# Altium project Kasil_DIOT_x86_board.PrjPcb (part 3 of 4)

## Sheet LOCAL_PWR.SchDoc
size 420 x 297 mm; SheetNumber: 8; SheetTotal: 11; ModifiedBy: -; CheckedDate: -; Title2: Title 2; DivGrp: WUT ISE; Designer: G.Kasprowicz
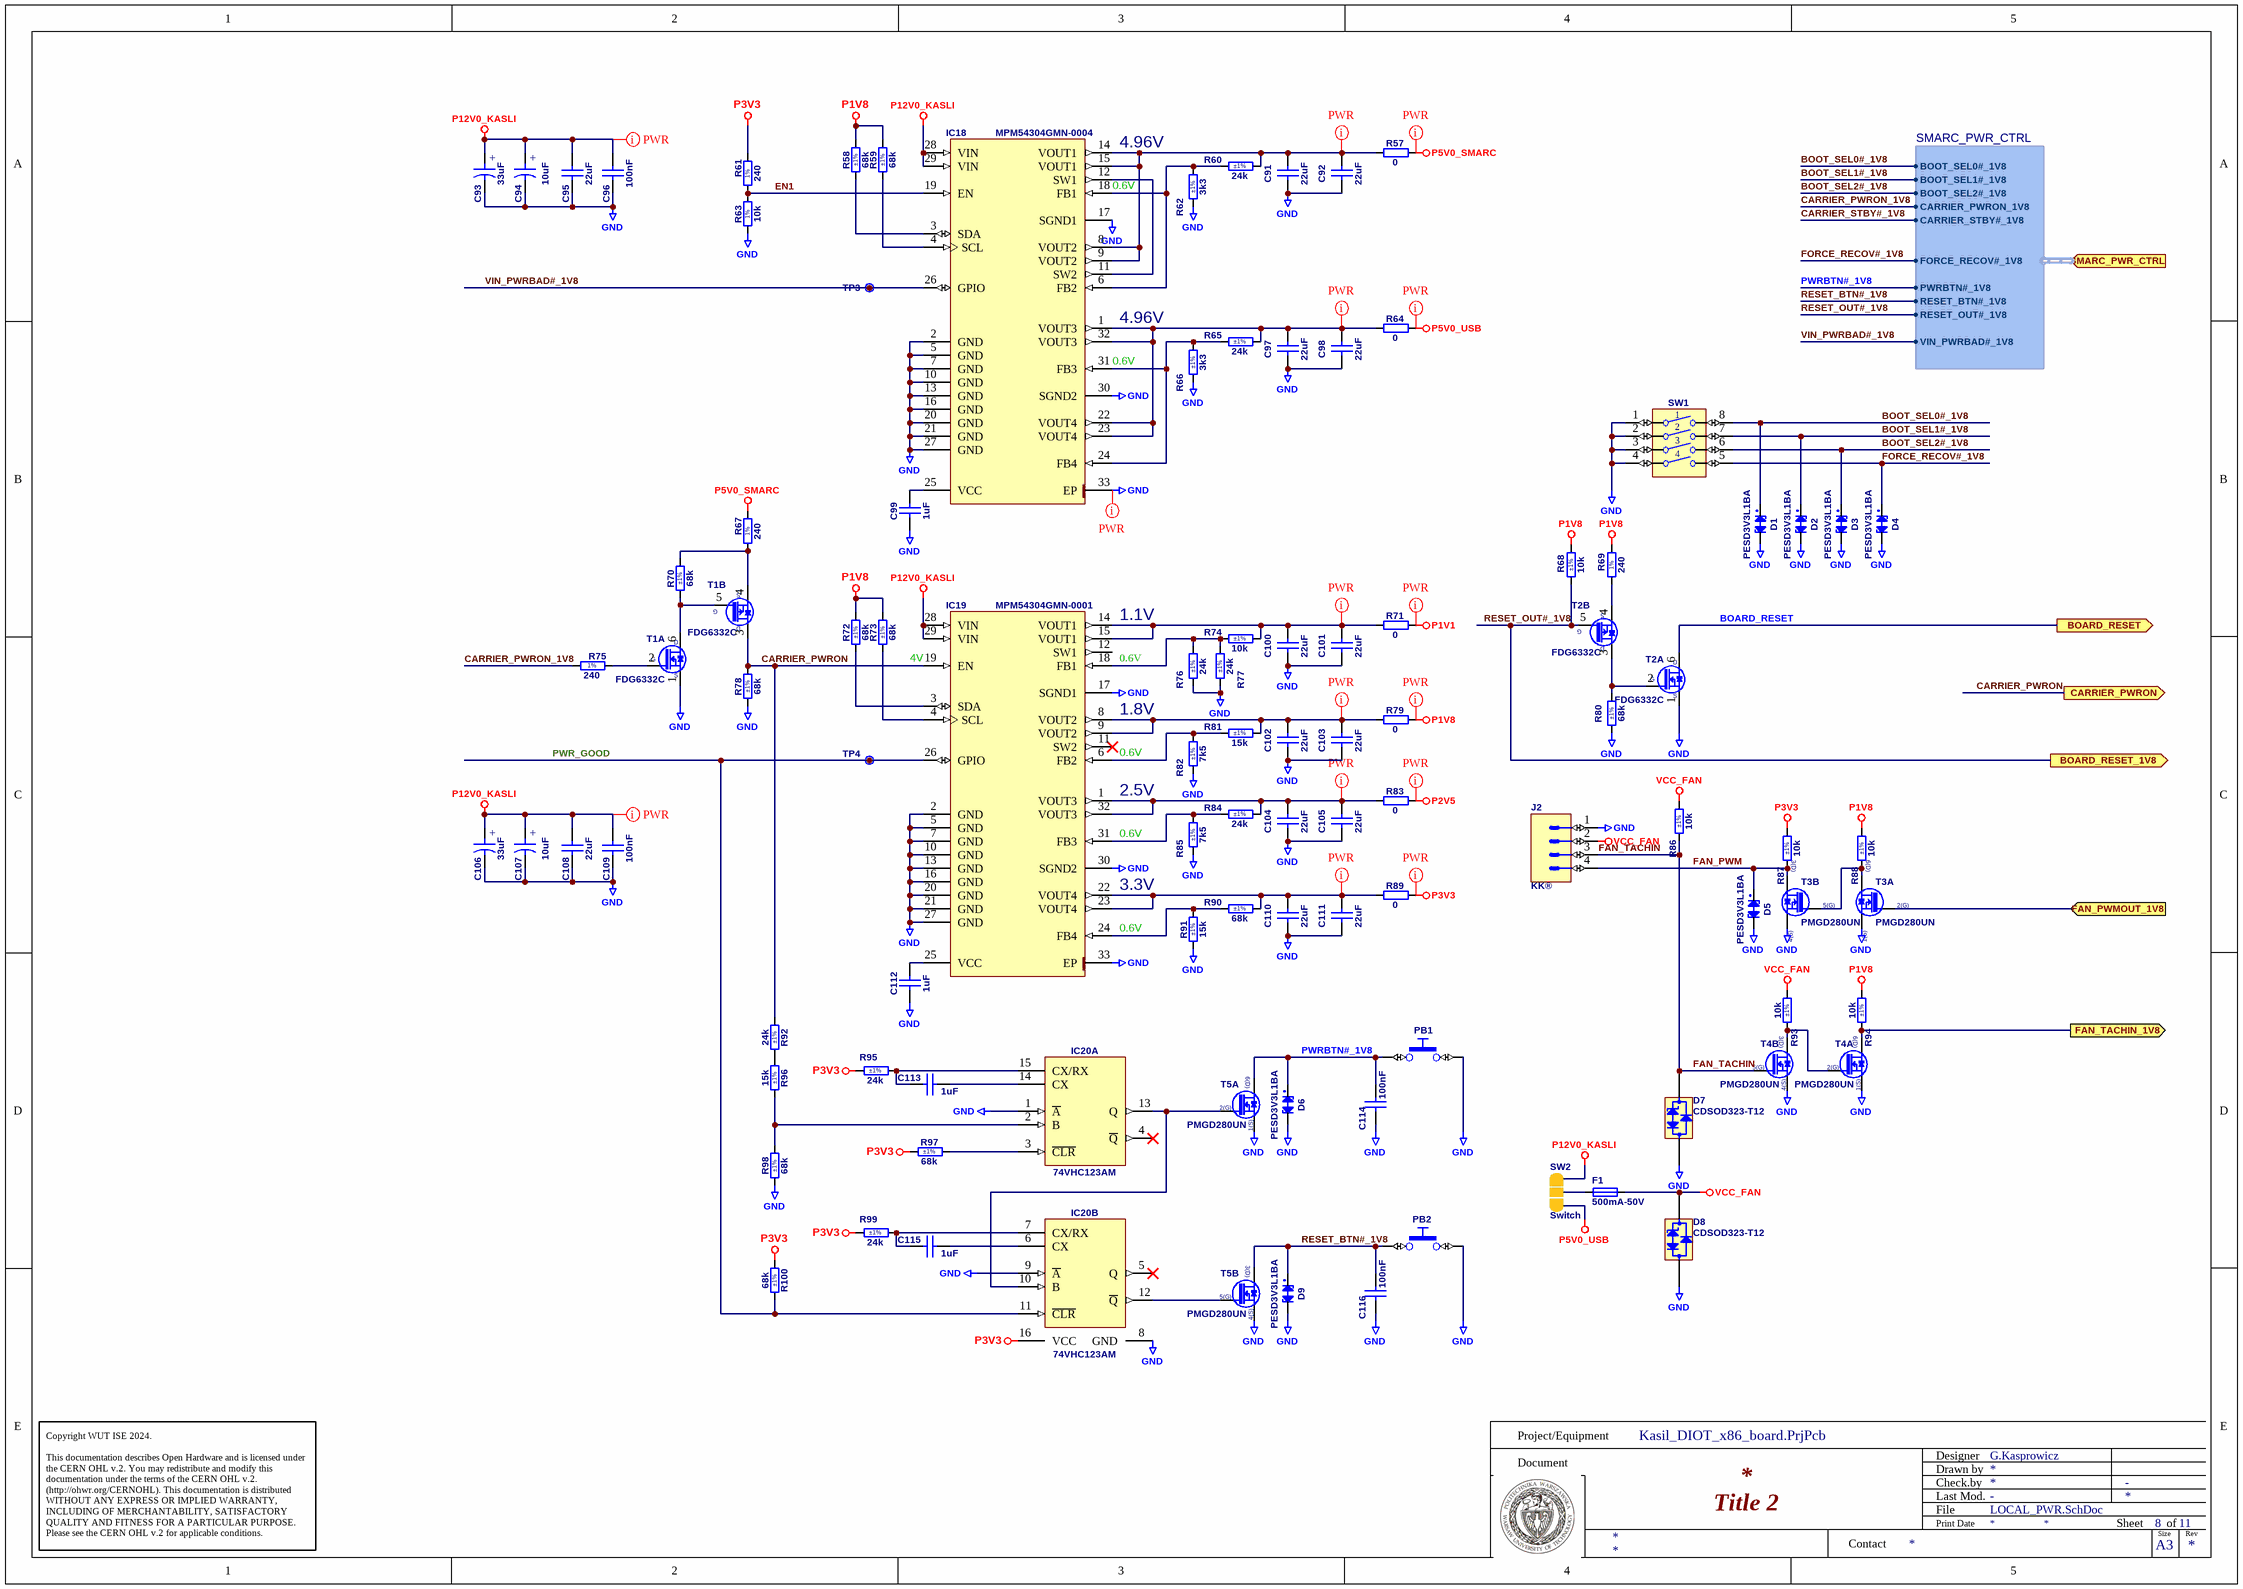
[diagram p6: LOCAL_PWR.SchDoc]

### Parts
C91  22uF  [CAPC2012X135N]
C92  22uF  [CAPC2012X135N]
C93  33uF  [CAPMP3528X210N]
C94  10uF  [CAPMP3216X180N]
C95  22uF  [CAPC2012X135N]
C96  100nF  [CAPC1005X55N]
C97  22uF  [CAPC2012X135N]
C98  22uF  [CAPC2012X135N]
C99  1uF  [CAPC1005X55N]
C100  22uF  [CAPC2012X135N]
C101  22uF  [CAPC2012X135N]
C102  22uF  [CAPC2012X135N]
C103  22uF  [CAPC2012X135N]
C104  22uF  [CAPC2012X135N]
C105  22uF  [CAPC2012X135N]
C106  33uF  [CAPMP3528X210N]
C107  10uF  [CAPMP3216X180N]
C108  22uF  [CAPC2012X135N]
C109  100nF  [CAPC1005X55N]
C110  22uF  [CAPC2012X135N]
C111  22uF  [CAPC2012X135N]
C112  1uF  [CAPC1005X55N]
C113  1uF  [CAPC1005X55N]
C114  100nF  [CAPC1005X55N]
C115  1uF  [CAPC1005X55N]
C116  100nF  [CAPC1005X55N]
D1  PESD3V3L1BA  [SOD2512X110N]
D2  PESD3V3L1BA  [SOD2512X110N]
D3  PESD3V3L1BA  [SOD2512X110N]
D4  PESD3V3L1BA  [SOD2512X110N]
D5  PESD3V3L1BA  [SOD2512X110N]
D6  PESD3V3L1BA  [SOD2512X110N]
D7  CDSOD323-T12  [SOD2513X114N]
D8  CDSOD323-T12  [SOD2513X114N]
D9  PESD3V3L1BA  [SOD2512X110N]
F1  500mA-50V  [FUSC_BOURNS_SF-0603F]
IC18  MPM54304GMN-0004  [MPS_MPM54304GMN]
IC19  MPM54304GMN-0001  [MPS_MPM54304GMN]
IC20  74VHC123AM  [SOIC127P600X175-16N]  (parts A,B of 2)
J2  KK®  [MOLEX_22-04-1041]
PB1  Push Button  [PB_TYCO_FSMSM]  (value not drawn)
PB2  Push Button  [PB_TYCO_FSMSM]  (value not drawn)
R57  0  [RESC2012X60N]
R58  68k  Tolerance: ±1%  [RESC1005X40N]
R59  68k  Tolerance: ±1%  [RESC1005X40N]
R60  24k  Tolerance: ±1%  [RESC1005X40N]
R61  240  [RESC1005X40N]
R62  3k3  Tolerance: ±1%  [RESC1005X40N]
R63  10k  [RESC1005X40N]
R64  0  [RESC2012X60N]
R65  24k  Tolerance: ±1%  [RESC1005X40N]
R66  3k3  Tolerance: ±1%  [RESC1005X40N]
R67  240  [RESC1005X40N]
R68  10k  Tolerance: ±1%  [RESC1005X40N]
R69  240  [RESC1005X40N]
R70  68k  Tolerance: ±1%  [RESC1005X40N]
R71  0  [RESC2012X60N]
R72  68k  Tolerance: ±1%  [RESC1005X40N]
R73  68k  Tolerance: ±1%  [RESC1005X40N]
R74  10k  Tolerance: ±1%  [RESC1005X40N]
R75  240  [RESC1005X40N]
R76  24k  Tolerance: ±1%  [RESC1005X40N]
R77  24k  Tolerance: ±1%  [RESC1005X40N]
R78  68k  Tolerance: ±1%  [RESC1005X40N]
R79  0  [RESC2012X60N]
R80  68k  Tolerance: ±1%  [RESC1005X40N]
R81  15k  Tolerance: ±1%  [RESC1005X40N]
R82  7k5  Tolerance: ±1%  [RESC1005X40N]
R83  0  [RESC2012X60N]
R84  24k  Tolerance: ±1%  [RESC1005X40N]
R85  7k5  Tolerance: ±1%  [RESC1005X40N]
R86  10k  Tolerance: ±1%  [RESC1005X40N]
R87  10k  Tolerance: ±1%  [RESC1005X40N]
R88  10k  Tolerance: ±1%  [RESC1005X40N]
R89  0  [RESC2012X60N]
R90  68k  Tolerance: ±1%  [RESC1005X40N]
R91  15k  Tolerance: ±1%  [RESC1005X40N]
R92  24k  Tolerance: ±1%  [RESC1005X40N]
R93  10k  Tolerance: ±1%  [RESC1005X40N]
R94  10k  Tolerance: ±1%  [RESC1005X40N]
R95  24k  Tolerance: ±1%  [RESC1005X40N]
R96  15k  Tolerance: ±1%  [RESC1005X40N]
R97  68k  Tolerance: ±1%  [RESC1005X40N]
R98  68k  Tolerance: ±1%  [RESC1005X40N]
R99  24k  Tolerance: ±1%  [RESC1005X40N]
R100  68k  Tolerance: ±1%  [RESC1005X40N]
SW1  Switch  [SW_DIPTRONICS_DHA-04TQ]  (value not drawn)
SW2  Switch  [JUMPSM3P]  (no BOM)
T1  FDG6332C  [SOT65P210X110-6N]  (parts A,B of 2)
T2  FDG6332C  [SOT65P210X110-6N]  (parts A,B of 2)
T3  PMGD280UN  [SOT65P210X110-6N]  (parts A,B of 2)
T4  PMGD280UN  [SOT65P210X110-6N]  (parts A,B of 2)
T5  PMGD280UN  [SOT65P210X110-6N]  (parts A,B of 2)
TP3  Test Point  [TPS127]  (value not drawn)  (no BOM)
TP4  Test Point  [TPS127]  (value not drawn)  (no BOM)

### Ports
BOARD_RESET (out), BOARD_RESET_1V8 (out), CARRIER_PWRON (out), FAN_PWMOUT_1V8 (in), FAN_TACHIN_1V8 (out), SMARC_PWR_CTRL (in, harness SMARC_PWR_CTRL)

### Harnesses
SMARC_PWR_CTRL: BOOT_SEL0#_1V8, BOOT_SEL1#_1V8, BOOT_SEL2#_1V8, CARRIER_PWRON_1V8, CARRIER_STBY#_1V8, FORCE_RECOV#_1V8, PWRBTN#_1V8, RESET_BTN#_1V8, RESET_OUT#_1V8, VIN_PWRBAD#_1V8

### Nets
GND: C91.1 C92.1 C93.2 C94.2 C95.1 C96.1 C97.1 C98.1 C99.1 C100.1 C101.1 C102.1 C103.1 C104.1 C105.1 C106.2 C107.2 C108.1 C109.1 C110.1 C111.1 C112.1 C114.1 C116.1 D1.2(C) D2.2(C) D3.2(C) D4.2(C) D5.2(C) D6.2(C) D7.2(A) D8.2(A) D9.2(C) IC18.2(GND) IC18.5(GND) IC18.7(GND) IC18.10(GND) IC18.13(GND) IC18.16(GND) IC18.17(SGND1) IC18.20(GND) IC18.21(GND) IC18.27(GND) IC18.30(SGND2) IC18.33(EP) IC19.2(GND) IC19.5(GND) IC19.7(GND) IC19.10(GND) IC19.13(GND) IC19.16(GND) IC19.17(SGND1) IC19.20(GND) IC19.21(GND) IC19.27(GND) IC19.30(SGND2) IC19.33(EP) IC20.1(~{A}) IC20.8(GND) IC20.9(~{A}) J2.1 PB1.2 PB2.2 R62.1 R63.1 R66.1 R76.1 R77.1 R78.1 R80.1 R82.1 R85.1 R91.1 R98.1 SW1.1 SW1.2 SW1.3 SW1.4 T1.1(S) T2.1(S) T3.1(S) T3.4(S) T4.1(S) T4.4(S) T5.1(S) T5.4(S)
P1V1: R71.2
P1V8: R58.2 R59.2 R68.2 R69.2 R72.2 R73.2 R79.2 R88.2 R94.2
P2V5: R83.2
P3V3: IC20.16(VCC) R61.2 R87.2 R89.2 R95.1 R97.1 R99.1 R100.1
P5V0_SMARC: R57.2 R67.2
P5V0_USB: R64.2 SW2.1
P12V0_KASLI: C93.1 C94.1 C95.2 C96.2 C106.1 C107.1 C108.2 C109.2 IC18.28(VIN) IC18.29(VIN) IC19.28(VIN) IC19.29(VIN) SW2.3
VCC: IC20.16(VCC)
VCC_FAN: D8.1(C) F1.2 J2.2 R86.2 R93.2
BOARD_RESET: T2.6(D) ; port BOARD_RESET
BOOT_SEL0#_1V8: D1.1(C) SW1.8 ; port SMARC_PWR_CTRL.BOOT_SEL0#_1V8
BOOT_SEL1#_1V8: D2.1(C) SW1.7 ; port SMARC_PWR_CTRL.BOOT_SEL1#_1V8
BOOT_SEL2#_1V8: D3.1(C) SW1.6 ; port SMARC_PWR_CTRL.BOOT_SEL2#_1V8
CARRIER_PWRON: IC19.19(EN) R78.2 R92.1 T1.3(D) ; port CARRIER_PWRON
CARRIER_PWRON_1V8: R75.1 ; port SMARC_PWR_CTRL.CARRIER_PWRON_1V8
EN1: IC18.19(EN) R61.1 R63.2
FAN_PWM: D5.1(C) J2.4 R87.1 T3.3(D)
FAN_TACHIN: D7.1(C) J2.3 R86.1 T4.5(G)
FORCE_RECOV#_1V8: D4.1(C) SW1.5 ; port SMARC_PWR_CTRL.FORCE_RECOV#_1V8
PWR_GOOD: IC19.26(GPIO) IC20.11(~{CLR}) R100.2 TP4.1
PWRBTN#_1V8: C114.2 D6.1(C) PB1.1 T5.6(D) ; port SMARC_PWR_CTRL.PWRBTN#_1V8
RESET_BTN#_1V8: C116.2 D9.1(C) PB2.1 T5.3(D) ; port SMARC_PWR_CTRL.RESET_BTN#_1V8
RESET_OUT#_1V8: R68.1 T2.5(G) ; port BOARD_RESET_1V8, port SMARC_PWR_CTRL.RESET_OUT#_1V8
VIN_PWRBAD#_1V8: IC18.26(GPIO) TP3.1 ; port SMARC_PWR_CTRL.VIN_PWRBAD#_1V8
NetC91_2: C91.2 C92.2 IC18.8(VOUT2) IC18.9(VOUT2) IC18.14(VOUT1) IC18.15(VOUT1) R57.1 R60.2
NetC97_2: C97.2 C98.2 IC18.1(VOUT3) IC18.22(VOUT4) IC18.23(VOUT4) IC18.32(VOUT3) R64.1 R65.2
NetC99_2: C99.2 IC18.25(VCC)
NetC100_2: C100.2 C101.2 IC19.14(VOUT1) IC19.15(VOUT1) R71.1 R74.2
NetC102_2: C102.2 C103.2 IC19.8(VOUT2) IC19.9(VOUT2) R79.1 R81.2
NetC104_2: C104.2 C105.2 IC19.1(VOUT3) IC19.32(VOUT3) R83.1 R84.2
NetC110_2: C110.2 C111.2 IC19.22(VOUT4) IC19.23(VOUT4) R89.1 R90.2
NetC112_2: C112.2 IC19.25(VCC)
NetC113_1: C113.1 IC20.15(CX/RX) R95.2
NetC113_2: C113.2 IC20.14(CX)
NetC115_1: C115.1 IC20.7(CX/RX) R99.2
NetC115_2: C115.2 IC20.6(CX)
NetF1_1: F1.1 SW2.2
NetIC18_3: IC18.3(SDA) R58.1
NetIC18_4: IC18.4(SCL) R59.1
NetIC18_6: IC18.6(FB2) IC18.18(FB1) R60.1 R62.2
NetIC18_11: IC18.11(SW2) IC18.12(SW1)
NetIC18_24: IC18.24(FB4) IC18.31(FB3) R65.1 R66.2
NetIC19_3: IC19.3(SDA) R72.1
NetIC19_4: IC19.4(SCL) R73.1
NetIC19_6: IC19.6(FB2) R81.1 R82.2
NetIC19_18: IC19.18(FB1) R74.1 R76.2 R77.2
NetIC19_24: IC19.24(FB4) R90.1 R91.2
NetIC19_31: IC19.31(FB3) R84.1 R85.2
NetIC20_2: IC20.2(B) R96.2 R98.2
NetIC20_3: IC20.3(~{CLR}) R97.2
NetIC20_10: IC20.10(B) IC20.13(Q) T5.2(G)
NetIC20_12: IC20.12(~{Q}) T5.5(G)
NetM1_P113: T3.2(G) ; port FAN_PWMOUT_1V8
NetM1_P114: R94.1 T4.6(D) ; port FAN_TACHIN_1V8
NetR67_1: R67.1 R70.2 T1.4(S)
NetR69_1: R69.1 T2.4(S)
NetR70_1: R70.1 T1.5(G) T1.6(D)
NetR75_2: R75.2 T1.2(G)
NetR80_2: R80.2 T2.2(G) T2.3(D)
NetR88_1: R88.1 T3.5(G) T3.6(D)
NetR92_2: R92.2 R96.1
NetR93_1: R93.1 T4.2(G) T4.3(D)

Not connected (* = marked no-connect by the designer): IC19 11(SW2)* 12(SW1); IC20 4(~{Q})* 5(Q)*

### Layout directives
net class PWR: GND, NetC91_2, NetC97_2, NetC100_2, NetC102_2, NetC104_2, NetC110_2, P1V1, P1V8, P2V5, P3V3, P5V0_SMARC, P5V0_USB, P12V0_KASLI

### Notes on the sheet
- (near IC18) 0.6V
- 4.96V
- 4V
- 0.6V
- 1.1V
- 1.8V
- 2.5V
- 3.3V
- Project/Equipment
- Document
- Designer
- Drawn by
- Check.by
- Copyright WUT ISE 2024.
  This documentation describes Open Hardware and is licensed under the CERN OHL v.2. You may redistribute and modify this documentation under the terms of the CERN OHL v.2. (http://ohwr.org/CERNOHL). This documentation is distributed WITHOUT ANY EXPRESS OR IMPLIED WARRANTY, INCLUDING OF MERCHANTABILITY, SATISFACTORY QUALITY AND FITNESS FOR A PARTICULAR PURPOSE. Please see the CERN OHL v.2 for applicable conditions.
- Contact
- File
- Last Mod.
- Print Date
- Sheet
- Size
- A3
- of
- Rev
- (in symbol CTE3216-18_10UF_16V_20%_AVX_TCJ) +
- (in symbol CTE3528-21_33UF_16V_10%) +
- (in symbol PMGD280UN, part A) 6(D); 2(G); 1(S)
- (in symbol PMGD280UN, part B) 3(D); 5(G); 4(S)
- (in symbol R0402_10K_1%_0.0625W_100PPM) 1%
- (in symbol R0402_240R_1%_0.0625W_100PPM) 1%

### Library data of the parts
C91 C92 C95 C97 C98 C100-C105 C108 C110 C111 = CC0805_22UF_16V_10%_X5R: Non-polarised capacitor; Manufacturer: GENERIC; Part Description: SMD Multilayer Chip Ceramic Capacitor; Manufacturer1 Part Number: C2012X5R1C226KT; Tolerance: ±10%; Voltage: 16V; TC: X5R; Manufacturer Part Number: CC0805_22UF_16V_10%_X5R; Part Number: CC0805_22UF_16V_10%_X5R; Value: 22uF; Component Kind: Standard; Component Type: Standard; Pin Count: 2; Status: Preferred; Case: 0805; Mounted: Yes; Socket: No; SMD: Yes; Sense: No; Manufacturer1 Example: TDK; Manufacturer1 ComponentHeight: 1.35mm; HelpURL: \\cern.ch\dfs\Applications\Altium\Datasheets\CC0805_X5R_TDK_C.pdf; Author: CERN DEM JLC; CreateDate: 25.10.2012; LatestRevisionDate: 25.10.2012
C93 C106 = CTE3528-21_33UF_16V_10%: Polarised capacitor; Part Description: Solid Tantalum Chip Capacitor; Manufacturer: GENERIC; Manufacturer1 Part Number: TAJB336K016R; Voltage: 16V; Tolerance: ±10%; Part Number: CTE3528-21_33UF_16V_10%; Component Kind: Standard; Component Type: Standard; Pin Count: 2; Value: 33uF; Status: Preferred; Manufacturer Part Number: CTE3528-21_33UF_16V_10%; Case: B; Mounted: Yes; Socket: No; SMD: Yes; Sense: No; HelpURL: \\cern.ch\dfs\Applications\Altium\Datasheets\CTE_AVX_TAJ.pdf; Author: CERN DEM JLC; CreateDate: 03.12.2007; LatestRevisionDate: 03.12.2007; Manufacturer1 Example: AVX; Manufacturer1 ComponentHeight: 2.1mm
C94 C107 = CTE3216-18_10UF_16V_20%_AVX_TCJ: Polarised capacitor; Part Description: ESR 0R200 Tantalum Solid Electrolytic Chip Capacitor with Conductive Polymer Electrode; Manufacturer: AVX; Manufacturer Part Number: TCJA106M016R0200; Voltage: 16V; Tolerance: ±20%; Part Number: CTE3216-18_10UF_16V_20%_AVX_TCJ; Component Kind: Standard; Component Type: Standard; Pin Count: 2; Value: 10uF; Status: Preferred; Case: A; Mounted: Yes; Socket: No; SMD: Yes; Sense: No; ComponentHeight: 1.8mm; HelpURL: \\cern.ch\dfs\Applications\Altium\Datasheets\CTE_AVX_TCJ.pdf; Author: CERN DEM JLC; CreateDate: 29.03.2012; LatestRevisionDate: 29.03.2012
C96 C109 C114 C116 = CC0402_100NF_16V_10%_X7R: Non-polarised capacitor; Part Description: SMD Multilayer Chip Ceramic Capacitor; Manufacturer: GENERIC; Manufacturer1 Part Number: GRM155R71C104KA88D; Voltage: 16V; TC: X7R; Tolerance: ±10%; Part Number: CC0402_100NF_16V_10%_X7R; Component Kind: Standard; Component Type: Standard; Pin Count: 2; Value: 100nF; Status: Not Recommended; Manufacturer Part Number: CC0402_100NF_16V_10%_X7R; Case: 0402; Mounted: Yes; Socket: No; SMD: Yes; Sense: No; Manufacturer1 Example: MURATA; Manufacturer1 ComponentHeight: 0.55mm; HelpURL: \\cern.ch\dfs\Applications\Altium\Datasheets\CC0402_X7R_MURATA_GRM.pdf; Author: CERN DEM JLC; CreateDate: 05/12/2013; LatestRevisionDate: 03/12/2007
C99 C112 C113 C115 = CC0402_1UF_16V_10%_X5R: Non-polarised capacitor; Part Description: SMD Multilayer Chip Ceramic Capacitor; Manufacturer: GENERIC; Manufacturer1 Part Number: C1005X5R1C105KT; Voltage: 16V; TC: X5R; Tolerance: ±10%; Part Number: CC0402_1UF_16V_10%_X5R; Component Kind: Standard; Component Type: Standard; Pin Count: 2; Value: 1uF; Status: Preferred; Manufacturer Part Number: CC0402_1UF_16V_10%_X5R; Case: 0402; Mounted: Yes; Socket: No; SMD: Yes; Sense: No; Manufacturer1 Example: TDK; Manufacturer1 ComponentHeight: 0.55mm; HelpURL: \\cern.ch\dfs\Applications\Altium\Datasheets\CC0402_X5R_TDK_C.pdf; Author: CERN DEM JLC
  C99 C112: CreateDate: 25.10.2012; LatestRevisionDate: 25.10.2012
  C113 C115: CreateDate: 2012-10-25; LatestRevisionDate: 2012-10-25
D1-D6 D9 = PESD3V3L1BA: Bi-Directional ESD Protection Diode; Part Description: Low Capacitance 23kV Bidirectional ESD Protection Diode; Manufacturer: NEXPERIA; Voltage: 3V3; Power: 500W; PressFit: No; Bonding: No; Part Number: PESD3V3L1BA; Component Kind: Standard; Component Type: Standard; Device: PESD3V3L1BA; PackageDescription: Small Outline Diode (SOD323), 1.70mm W X 1.25mm L X 1.10mm H Body,  IPC Medium Density; Manufacturer Part Number: PESD3V3L1BA; Pin Count: 2; Case: SOD323; Mounted: Yes; Socket: No; SMD: Yes; Sense: No; ComponentHeight: 1.1mm; HelpURL: \\cern.ch\dfs\Applications\Altium\Datasheets\PESD3V3L1BA.pdf; Author: CERN DEM JMW; CreateDate: 28.07.2021; LatestRevisionDate: 28.07.2021
D7 D8 = CDSOD323-T12: Unidirectional ESD Protection for Transient Voltage Suppressor Diode; Manufacturer: BOURNS; Voltage: 12V; Power: 350W; PressFit: No; Bonding: No; Part Number: CDSOD323-T12; Component Kind: Standard; Component Type: Standard; Device: CDSOD323-T12; PackageDescription: SOD-323 Diode; 1.75mm W X 1.30mm L X 1.14mm H Body, IPC Medium Density; Part Description: Unidirectional ESD Protection for Transient Voltage Suppressor Diode; Manufacturer Part Number: CDSOD323-T12; Pin Count: 2; Case: SOD-323; Mounted: Yes; Socket: No; SMD: Yes; Sense: No; ComponentHeight: 1.14mm; HelpURL: \\cern.ch\dfs\Applications\Altium\Datasheets\CDSOD323-T12.pdf; Author: CERN DEM BC; CreateDate: 26.07.2017; LatestRevisionDate: 26.07.2017
F1 = FUS0603_BOURNS-SF-0603F050-2: Fuse; Part Description: Fast Acting Thin Film Chip Fuse for Overcurrent Protection, SinglFuse™ SF-0603F  Series; Manufacturer: BOURNS; PressFit: No; Part Number: FUS0603_BOURNS-SF-0603F050-2; Component Kind: Standard; Component Type: Standard; Pin Count: 2; Case: 0603; PackageDescription: Chip Fuse, 2-Leads, Body 1.6mm x 0.8mm, IPC Medium Density; Family: Fuse; Mounted: Yes; Socket: No; SMD: Yes; Sense: No; Value: 500mA-50V; Manufacturer Part Number: SF-0603F050-2; ComponentHeight: 0.55mm; HelpURL: \\cern.ch\dfs\Applications\Altium\Datasheets\FUSC_BOURNS_SF-0603F.pdf; Author: CERN DEM JLC; CreateDate: 01.02.2017; LatestRevisionDate: 01.02.2017
IC18 = MPM54304GMN-XXXX: Quad-Output Power Module with I2C and MTP; Part Number: MPM54304GMN-002; Part Description: 4V to 16V Input, Quad-Output Power Module with I2C and MTP; Manufacturer: MPS (MONOLITIC  POWER SYSTEMS); PressFit: No; Bonding: No; Component Kind: Standard; Component Type: Standard; Device: MPM54304GMN-0004; PackageDescription: MPS LGA-33 Case, 0.65mm Pitch, Rect.; 32 Pin, 7.00mm L X 7.00mm W X 2.10mm H body (w/Thermal Tab 3.55 X 3.55mm); Manufacturer Part Number: MPM54304GMN-002; Pin Count: 33; Case: QFN32; Mounted: Yes; Socket: No; SMD: Yes; Sense: No; ComponentHeight: 2.1mm; HelpURL: \\cern.ch\dfs\Applications\Altium\Datasheets\MPM54304GMN.pdf; Author: CERN DEM BC; CreateDate: 09.11.2020; LatestRevisionDate: 23.11.2022
IC19 = MPM54304GMN-XXXX: Quad-Output Power Module with I2C and MTP; Part Description: 4V to 16V Input, Quad-Output Power Module with I2C and MTP; Manufacturer: MPS (MONOLITIC  POWER SYSTEMS); Manufacturer Part Number: MPM54304GMN-002; PressFit: No; Bonding: No; Part Number: MPM54304GMN-0001; Component Kind: Standard; Component Type: Standard; Device: MPM54304GMN-0001; PackageDescription: MPS LGA-33 Case, 0.65mm Pitch, Rect.; 32 Pin, 7.00mm L X 7.00mm W X 2.10mm H body (w/Thermal Tab 3.55 X 3.55mm); Pin Count: 33; Case: QFN32; Mounted: Yes; Socket: No; SMD: Yes; Sense: No; ComponentHeight: 2.1mm; HelpURL: \\cern.ch\dfs\Applications\Altium\Datasheets\MPM54304GMN.pdf; Author: CERN DEM BC; CreateDate: 09.11.2020; LatestRevisionDate: 23.11.2022
IC20 = 74VHC123AM: Retriggerable Monostable Multivibrator; Part Description: Dual Retriggerable Monostable Multivibrator; Manufacturer: FAIRCHILD SEMICONDUCTOR; PressFit: No; Bonding: No; Part Number: 74VHC123AM; Component Kind: Standard; Component Type: Standard; Device: 74VHC123AM; PackageDescription: SOIC, 1.27mm Pitch; 16 Pin, 3.90mm W x 9.90mm L X 1.75mm H Body, IPC Medium Density; Manufacturer Part Number: 74VHC123AM; Pin Count: 16; Case: SOIC16; Mounted: Yes; Socket: No; SMD: Yes; Sense: No; ComponentHeight: 1.75mm; Author: CERN DEM BC; HelpURL: \\cern.ch\dfs\Applications\Altium\Datasheets\74VHC123AM.pdf; CreateDate: 23.08.2016; LatestRevisionDate: 23.08.2016
J2 = MOLEX_22-04-1041: Connector 4 Male; Part Description: 2.5mm (.100") Pitch KK® Wire-to-Board Header, Vertical, with Friction Lock, 4 Circuits, Tin (Sn) Plating; Manufacturer: MOLEX; PressFit: No; Part Number: MOLEX_22-04-1041; Component Kind: Standard; Component Type: Standard; Pin Count: 4; Family: KK®; Mounted: Yes; Socket: No; SMD: No; Sense: No; Status: Obsolete; Manufacturer Part Number: 22-04-1041; ComponentHeight: 11.7mm; HelpURL: \\cern.ch\dfs\Applications\Altium\Datasheets\MOLEX_22-04-1041.pdf; Author: CERN DEM JLC; CreateDate: 09.02.2012; LatestRevisionDate: 09.02.2012
PB1 PB2 = PB_TYCO_FSMSM: Push-Button Switch SPST; Part Description: 12VDC 50mA SPST Tactile Push-Button Switch; Manufacturer: TYCO ELECTRONICS; Manufacturer Part Number: FSMSM or 1437566-3; PressFit: No; Part Number: PB_TYCO_FSMSM; Component Kind: Standard; Component Type: Standard; Pin Count: 2; PackageDescription: Body 3.5x6.0mm, Pushbutton Switch, TYCO ALCOSWITCH FSMSM Serie; Family: Push Button; Mounted: Yes; Socket: No; SMD: Yes; Sense: No; Status: None; ComponentHeight: 4.3mm; HelpURL: \\cern.ch\dfs\Applications\Altium\Datasheets\PB_TYCO_FSMSM.pdf; Author: CERN DEM JLC; CreateDate: 30.06.2008; LatestRevisionDate: 21.06.2012
R57 R64 R71 R79 R83 R89 = R0805_0R_JUMPER: Resistor; Part Description: 2A (0.05R Max DC Resistance) Zero Ohm Jumper; Manufacturer: GENERIC; Manufacturer1 Part Number: NRC10Z0; PressFit: No; Part Number: R0805_0R_JUMPER; Component Kind: Standard; Component Type: Standard; Pin Count: 2; Value: 0; Status: Preferred; Manufacturer Part Number: R0805_0R_JUMPER; Case: 0805; Mounted: Yes; Sense: No; Socket: No; SMD: Yes; Manufacturer1 Example: NIC COMPONENT; Manufacturer1 ComponentHeight: 0.6mm; HelpURL: \\cern.ch\dfs\Applications\Altium\Datasheets\R0805_NIC_NRC.pdf; Author: CERN DEM JLC; CreateDate: 03.12.2007; LatestRevisionDate: 13.03.2008
R58 R59 R70 R72 R73 R78 R80 R90 R97 R98 R100 = R0402_68K_1%_0.0625W_100PPM: Resistor - 1%; Part Description: General Purpose Thick Film Chip Resistor; Manufacturer: GENERIC; Manufacturer1 Part Number: 232270676803L; TC: ±100ppm/°C; PressFit: No; Part Number: R0402_68K_1%_0.0625W_100PPM; Component Kind: Standard; Component Type: Standard; Pin Count: 2; Value: 68k; Status: Not Recommended; Power: 0.0625W; Manufacturer Part Number: R0402_68K_1%_0.0625W_100PPM; Case: 0402; Mounted: Yes; Sense: No; Socket: No; SMD: Yes; Manufacturer1 Example: YAGEO PHYCOMP; Manufacturer1 ComponentHeight: 0.4mm; HelpURL: \\cern.ch\dfs\Applications\Altium\Datasheets\R0402_Phycomp_RC0402.pdf; Author: CERN DEM JLC; CreateDate: 03.12.2007; LatestRevisionDate: 17.10.2012
R60 R65 R76 R77 R84 R92 R95 R99 = R0402_24K_1%_0.0625W_100PPM: Resistor - 1%; Part Description: General Purpose Thick Film Chip Resistor; Manufacturer: GENERIC; Manufacturer1 Part Number: 232270672403L; TC: ±100ppm/°C; PressFit: No; Part Number: R0402_24K_1%_0.0625W_100PPM; Component Kind: Standard; Component Type: Standard; Pin Count: 2; Value: 24k; Status: Not Recommended; Power: 0.0625W; Manufacturer Part Number: R0402_24K_1%_0.0625W_100PPM; Case: 0402; Mounted: Yes; Sense: No; Socket: No; SMD: Yes; Manufacturer1 Example: YAGEO PHYCOMP; Manufacturer1 ComponentHeight: 0.4mm; HelpURL: \\cern.ch\dfs\Applications\Altium\Datasheets\R0402_Phycomp_RC0402.pdf; Author: CERN DEM JLC; CreateDate: 03.12.2007; LatestRevisionDate: 17.10.2012
R61 R67 R69 R75 = R0402_240R_1%_0.0625W_100PPM: Resistor - 1%; Part Description: General Purpose Thick Film Chip Resistor; Manufacturer: GENERIC; Manufacturer1 Part Number: 232270672401L; TC: ±100ppm/°C; PressFit: No; Part Number: R0402_240R_1%_0.0625W_100PPM; Component Kind: Standard; Component Type: Standard; Pin Count: 2; Value: 240; Status: Not Recommended; Power: 0.0625W; Tolerance: ±1%; Manufacturer Part Number: R0402_240R_1%_0.0625W_100PPM; Case: 0402; Mounted: Yes; Sense: No; Socket: No; SMD: Yes; Manufacturer1 Example: YAGEO PHYCOMP; Manufacturer1 ComponentHeight: 0.4mm; HelpURL: \\cern.ch\dfs\Applications\Altium\Datasheets\R0402_Phycomp_RC0402.pdf; Author: CERN DEM JLC; CreateDate: 03.12.2007; LatestRevisionDate: 17.10.2012
R62 R66 = R0402_3K3_1%_0.0625W_100PPM: Resistor - 1%; Part Description: General Purpose Thick Film Chip Resistor; Manufacturer: GENERIC; Manufacturer1 Part Number: 232270673302L; TC: ±100ppm/°C; PressFit: No; Part Number: R0402_3K3_1%_0.0625W_100PPM; Component Kind: Standard; Component Type: Standard; Pin Count: 2; Value: 3k3; Status: Not Recommended; Power: 0.0625W; Manufacturer Part Number: R0402_3K3_1%_0.0625W_100PPM; Case: 0402; Mounted: Yes; Sense: No; Socket: No; SMD: Yes; Manufacturer1 Example: YAGEO PHYCOMP; Manufacturer1 ComponentHeight: 0.4mm; HelpURL: \\cern.ch\dfs\Applications\Altium\Datasheets\R0402_Phycomp_RC0402.pdf; Author: CERN DEM JLC; CreateDate: 03.12.2007; LatestRevisionDate: 17.10.2012
R63 R68 R74 R86-R88 R93 R94 = R0402_10K_1%_0.0625W_100PPM: Resistor - 1%; Part Description: General Purpose Thick Film Chip Resistor; Manufacturer: GENERIC; Manufacturer1 Part Number: 232270671003L; TC: ±100ppm/°C; PressFit: No; Part Number: R0402_10K_1%_0.0625W_100PPM; Component Kind: Standard; Component Type: Standard; Pin Count: 2; Value: 10k; Status: Not Recommended; Power: 0.0625W; Manufacturer Part Number: R0402_10K_1%_0.0625W_100PPM; Case: 0402; Mounted: Yes; Sense: No; Socket: No; SMD: Yes; Manufacturer1 Example: YAGEO PHYCOMP; Manufacturer1 ComponentHeight: 0.4mm; HelpURL: \\cern.ch\dfs\Applications\Altium\Datasheets\R0402_Phycomp_RC0402.pdf; Author: CERN DEM JLC; CreateDate: 03.12.2007; LatestRevisionDate: 17.10.2012
  R63: Tolerance: ±1%
R81 R91 R96 = R0402_15K_1%_0.0625W_100PPM: Resistor - 1%; Part Description: General Purpose Thick Film Chip Resistor; Manufacturer: GENERIC; Manufacturer1 Part Number: CRCW040215K0FK; TC: ±100ppm/°C; PressFit: No; Part Number: R0402_15K_1%_0.0625W_100PPM; Component Kind: Standard; Component Type: Standard; Pin Count: 2; Value: 15k; Status: Preferred; Power: 0.0625W; Manufacturer Part Number: R0402_15K_1%_0.0625W_100PPM; Case: 0402; Mounted: Yes; Sense: No; Socket: No; SMD: Yes; Manufacturer1 Example: VISHAY; Manufacturer1 ComponentHeight: 0.4mm; HelpURL: \\cern.ch\dfs\Applications\Altium\Datasheets\R0402_VISHAY_CRCW e3.pdf; Author: CERN DEM JMW; CreateDate: 06.07.2015; LatestRevisionDate: 06.07.2015
R82 R85 = R0402_7K5_1%_0.0625W_100PPM: Resistor - 1%; Part Description: General Purpose Thick Film Chip Resistor; Manufacturer: GENERIC; Manufacturer1 Part Number: 232270677502L; TC: ±100ppm/°C; PressFit: No; Part Number: R0402_7K5_1%_0.0625W_100PPM; Component Kind: Standard; Component Type: Standard; Pin Count: 2; Value: 7k5; Status: Not Recommended; Power: 0.0625W; Manufacturer Part Number: R0402_7K5_1%_0.0625W_100PPM; Case: 0402; Mounted: Yes; Sense: No; Socket: No; SMD: Yes; Manufacturer1 Example: YAGEO PHYCOMP; Manufacturer1 ComponentHeight: 0.4mm; HelpURL: \\cern.ch\dfs\Applications\Altium\Datasheets\R0402_Phycomp_RC0402.pdf; Author: CERN DEM JLC; CreateDate: 03.12.2007; LatestRevisionDate: 17.10.2012
SW1 = SW_DIPTRONICS_DHA-04TQ: 4 Ways SPST DIP Switch; Part Description: 4 Way SPST SMD DIP Switch, Latched, Contact Rating 25mA 24VDC, DHA Series; PressFit: No; Part Number: SW_DIPTRONICS_DHA-04TQ; Component Kind: Standard; Component Type: Standard; Pin Count: 8; PackageDescription: Pitch 1.27mm, Body 6.2x6.2mm, 4 Ways SPST Surface-Mount DIP Switch, DIPTRONICS DHA Series; Family: Switch; Mounted: Yes; Socket: No; SMD: Yes; Sense: No; Status: None; Manufacturer: DIPTRONICS; Manufacturer Part Number: DHA-04TQ; ComponentHeight: 2.3mm; HelpURL: \\cern.ch\dfs\Applications\Altium\Datasheets\SW_DIPTRONICS_DHA-04TQ.pdf; Author: CERN DEM JLC; CreateDate: 30.05.2017; LatestRevisionDate: 30.05.2017
SW2 = JUMPSM3P: 3 SMD Pads for Bound by Solder  Drop; Part Description: 3 Pads for Bound by Solder Drop; Manufacturer: None; Mounted: No; PressFit: No; Part Number: JUMPSM3P; Component Type: Standard (No BOM); Pin Count: 3; PackageDescription: 3 Pads for Bound by Solder Drop; Family: Switch; Socket: No; SMD: No; Sense: No; Status: None; Manufacturer Part Number: None; ComponentHeight: 0mm; HelpURL: None; Author: CERN DEM JLC; CreateDate: 19.11.2013; LatestRevisionDate: 12.02.2021
T1 T2 = FDG6332C: 20V N & P-Channel PowerTrench MOSFETs; Part Description: 20V, N & P-Channel PowerTrench® MOSFETs; Manufacturer: FAIRCHILD SEMICONDUCTOR; PressFit: No; Bonding: No; Part Number: FDG6332C; Component Kind: Standard; Component Type: Standard; Device: FDG6332C; PackageDescription: SOT363, SC-88, 0.65mm Pitch; 6 Pin, 1.25mm W X 2.00mm L X 1.10mm H body, IPC Medium Density; Manufacturer Part Number: FDG6332C; Pin Count: 6; Case: SOT363; Mounted: Yes; Socket: No; SMD: Yes; Sense: No; ComponentHeight: 1.1mm; HelpURL: \\cern.ch\dfs\Applications\Altium\Datasheets\FDG6332C.pdf; Author: CERN DEM JLC; CreateDate: 25.11.2008; LatestRevisionDate: 25.11.2008
T3-T5 = PMGD280UN: Dual N-Channel micro TrenchMOS™ Ultra Low Level FET; Part Description: 20V 870mA Dual N-Channel micro TrenchMOS™ Ultra Low Level FET; Manufacturer: NXP SEMICONDUCTORS; PressFit: No; Bonding: No; Part Number: PMGD280UN; Component Kind: Standard; Component Type: Standard; Device: PMGD280UN; PackageDescription: SOT363, SC70-6, 0.65mm Pitch; 6 Pin, 1.25mm W X 2.00mm L X 1.10mm H body, IPC Medium Density; Manufacturer Part Number: PMGD280UN; Pin Count: 6; Case: SOT363; Mounted: Yes; Socket: No; SMD: Yes; Sense: No; ComponentHeight: 1.1mm; HelpURL: \\cern.ch\dfs\Applications\Altium\Datasheets\PMGD280UN.pdf; Author: CERN DEM JLC; CreateDate: 19.11.2014; LatestRevisionDate: 19.11.2014
TP3 TP4 = SMD_PAD_1.27X1.27MM: Part Description: 1.27mm x 1.27mm PCB Copper Area (SMD Test Point); Mounted: No; Part Number: SMD_PAD_1.27X1.27MM; Component Type: Standard (No BOM); Pin Count: 1; Family: Test Point; Socket: No; SMD: Yes; Sense: No; Status: None; ComponentHeight: 0mm; HelpURL: Undefined; Author: CERN DEM JLC; CreateDate: 12.01.2008; LatestRevisionDate: 12.01.2008; PackageDescription: 1.27mm x 1.27mm PCB Copper Area (SMD Test Point)

## Sheet KASLI_CON.SchDoc
size 420 x 297 mm; SheetNumber: 3; SheetTotal: 11; ModifiedBy: -; CheckedDate: -; Title2: Title 2; DivGrp: WUT ISE; Designer: G.Kasprowicz
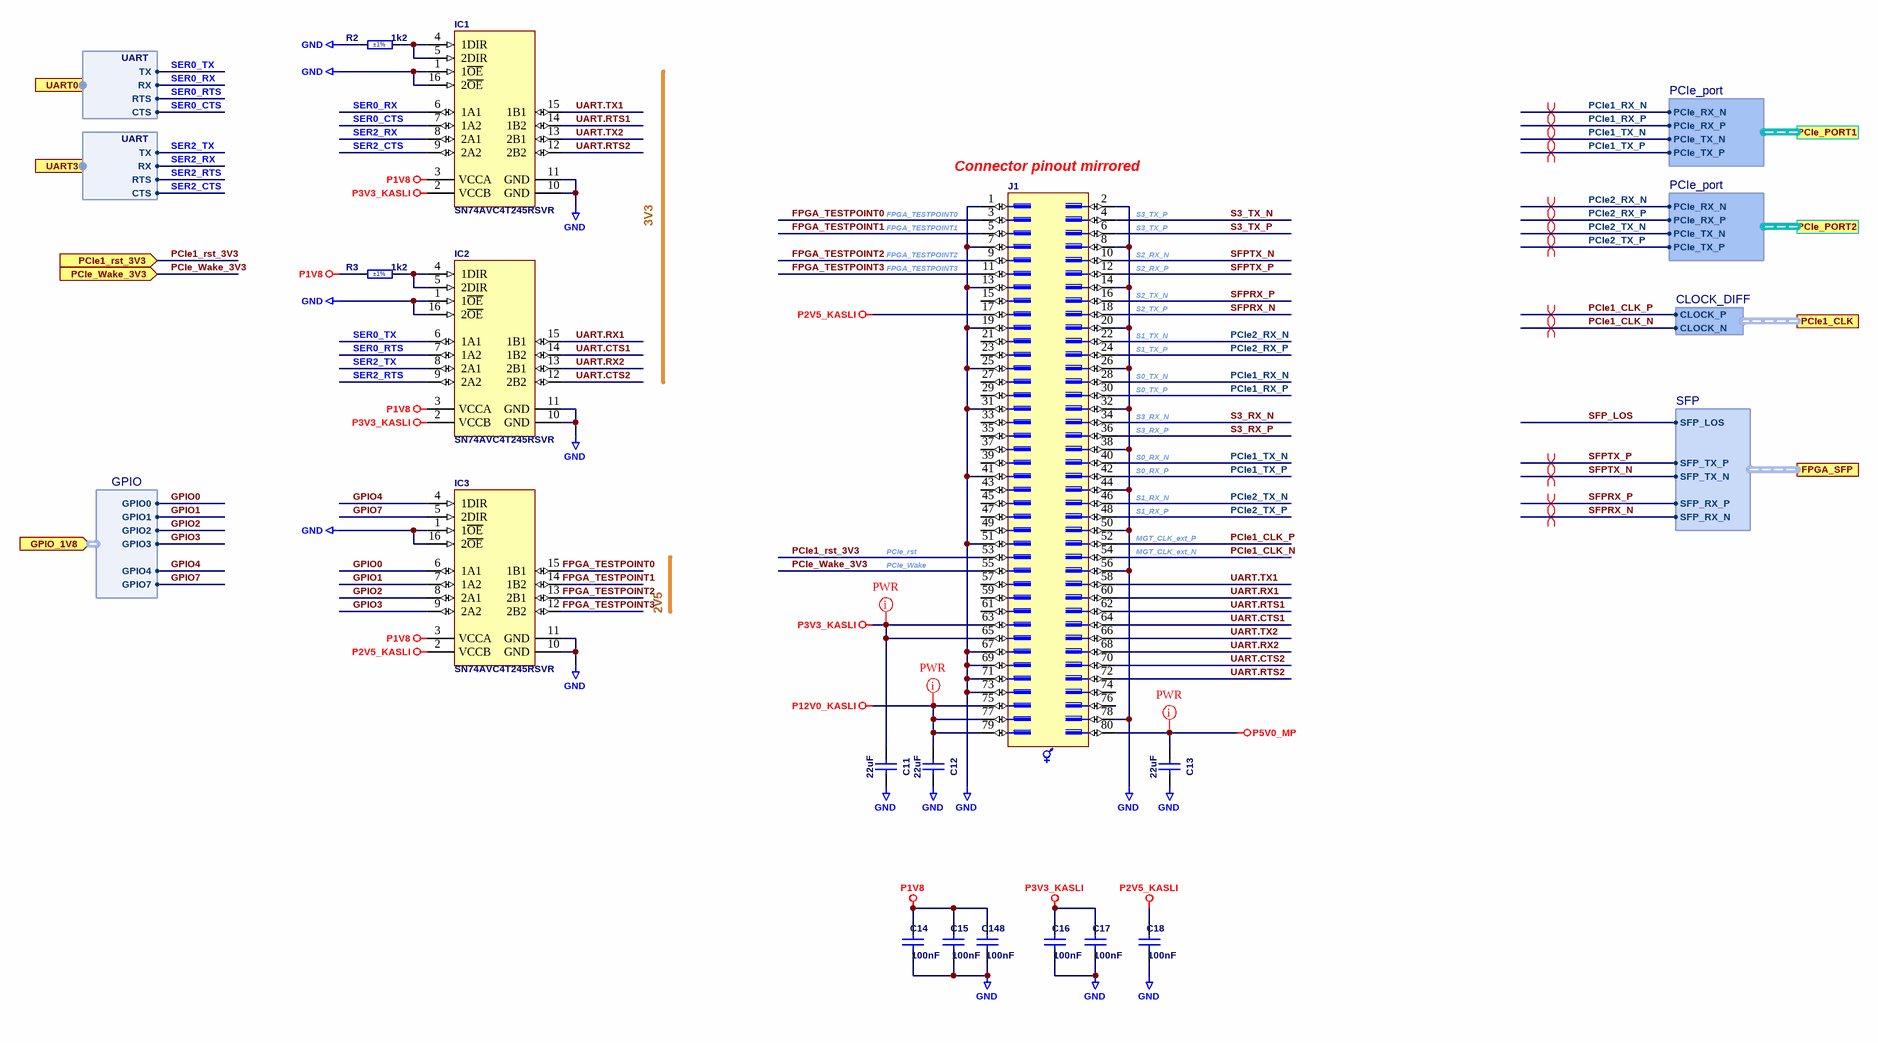
[diagram p7: KASLI_CON.SchDoc]

### Parts
C11  22uF  [CAPC2012X135N]
C12  22uF  [CAPC2012X135N]
C13  22uF  [CAPC2012X135N]
C14  100nF  [CAPC1005X55N]
C15  100nF  [CAPC1005X55N]
C16  100nF  [CAPC1005X55N]
C17  100nF  [CAPC1005X55N]
C18  100nF  [CAPC1005X55N]
C148  100nF  [CAPC1005X55N]
IC1  SN74AVC4T245RSVR  [QFN40P180X260X55-16N]
IC2  SN74AVC4T245RSVR  [QFN40P180X260X55-16N]
IC3  SN74AVC4T245RSVR  [QFN40P180X260X55-16N]
J1  (no value)  [SAMTEC_LSS-140-01-L-DV-A]
R2  1k2  Tolerance: ±1%  [RESC1005X40N]
R3  1k2  Tolerance: ±1%  [RESC1005X40N]

### Ports
FPGA_SFP (harness SFP), GPIO_1V8 (in, harness GPIO), PCIe1_CLK (harness CLOCK_DIFF), PCIe1_rst_3V3 (in), PCIe_PORT1 (harness PCIe_port), PCIe_PORT2 (harness PCIe_port), PCIe_Wake_3V3 (in), UART0 (harness UART), UART3 (harness UART)

### Harnesses
CLOCK_DIFF: CLOCK_P, CLOCK_N
PCIe_port: PCIe_TX_P, PCIe_TX_N, PCIe_RX_P, PCIe_RX_N
SFP: SFP_TX_P, SFP_TX_N, SFP_RX_P, SFP_RX_N, SFP_LOS
UART: TX, RX, RTS, CTS
GPIO: GPIO0, GPIO1, GPIO2, GPIO3, GPIO4, GPIO7

### Nets
GND: C11.1 C12.1 C13.1 C14.1 C15.1 C16.1 C17.1 C18.1 C148.1 IC1.1(1~{OE}) IC1.10(GND) IC1.11(GND) IC1.16(2~{OE}) IC2.1(1~{OE}) IC2.10(GND) IC2.11(GND) IC2.16(2~{OE}) IC3.1(1~{OE}) IC3.10(GND) IC3.11(GND) IC3.16(2~{OE}) J1.1 J1.2 J1.7 J1.8 J1.13 J1.14 J1.19 J1.20 J1.25 J1.26 J1.31 J1.32 J1.38 J1.41 J1.44 J1.50 J1.51 J1.56 J1.67 J1.69 J1.71 J1.73 J1.78 R2.1
P1V8: C14.2 C15.2 C148.2 IC1.3(VCCA) IC2.3(VCCA) IC3.3(VCCA) R3.1
P2V5_KASLI: C18.2 IC3.2(VCCB) J1.17
P3V3_KASLI: C11.2 C16.2 C17.2 IC1.2(VCCB) IC2.2(VCCB) J1.63 J1.65
P5V0_MP: C13.2 J1.80
P12V0_KASLI: C12.2 J1.75 J1.77 J1.79
FPGA_TESTPOINT0: IC3.15(1B1) J1.3
FPGA_TESTPOINT1: IC3.14(1B2) J1.5
FPGA_TESTPOINT2: IC3.13(2B1) J1.9
FPGA_TESTPOINT3: IC3.12(2B2) J1.11
GPIO0: IC3.6(1A1) ; port GPIO_1V8.GPIO0
GPIO1: IC3.7(1A2) ; port GPIO_1V8.GPIO1
GPIO2: IC3.8(2A1) ; port GPIO_1V8.GPIO2
GPIO3: IC3.9(2A2) ; port GPIO_1V8.GPIO3
GPIO4: IC3.4(1DIR) ; port GPIO_1V8.GPIO4
GPIO7: IC3.5(2DIR) ; port GPIO_1V8.GPIO7
PCIe1_CLK_N: J1.54 ; port PCIe1_CLK.CLOCK_N
PCIe1_CLK_P: J1.52 ; port PCIe1_CLK.CLOCK_P
PCIe1_rst_3V3: J1.53 ; port PCIe1_rst_3V3
PCIe1_RX_N: J1.28 ; port PCIe_PORT1.PCIe_RX_N
PCIe1_RX_P: J1.30 ; port PCIe_PORT1.PCIe_RX_P
PCIe1_TX_N: J1.40 ; port PCIe_PORT1.PCIe_TX_N
PCIe1_TX_P: J1.42 ; port PCIe_PORT1.PCIe_TX_P
PCIe2_RX_N: J1.22 ; port PCIe_PORT2.PCIe_RX_N
PCIe2_RX_P: J1.24 ; port PCIe_PORT2.PCIe_RX_P
PCIe2_TX_N: J1.46 ; port PCIe_PORT2.PCIe_TX_N
PCIe2_TX_P: J1.48 ; port PCIe_PORT2.PCIe_TX_P
PCIe_Wake_3V3: J1.55 ; port PCIe_Wake_3V3
S3_RX_N: J1.34
S3_RX_P: J1.36
S3_TX_N: J1.4
S3_TX_P: J1.6
SER0_CTS: IC1.7(1A2) ; port UART0.CTS
SER0_RTS: IC2.7(1A2) ; port UART0.RTS
SER0_RX: IC1.6(1A1) ; port UART0.RX
SER0_TX: IC2.6(1A1) ; port UART0.TX
SER2_CTS: IC1.9(2A2) ; port UART3.CTS
SER2_RTS: IC2.9(2A2) ; port UART3.RTS
SER2_RX: IC1.8(2A1) ; port UART3.RX
SER2_TX: IC2.8(2A1) ; port UART3.TX
SFPRX_N: J1.18 ; port FPGA_SFP.SFP_RX_N
SFPRX_P: J1.16 ; port FPGA_SFP.SFP_RX_P
SFPTX_N: J1.10 ; port FPGA_SFP.SFP_TX_N
SFPTX_P: J1.12 ; port FPGA_SFP.SFP_TX_P
UART.CTS1: IC2.14(1B2) J1.64
UART.CTS2: IC2.12(2B2) J1.70
UART.RTS1: IC1.14(1B2) J1.62
UART.RTS2: IC1.12(2B2) J1.72
UART.RX1: IC2.15(1B1) J1.60
UART.RX2: IC2.13(2B1) J1.68
UART.TX1: IC1.15(1B1) J1.58
UART.TX2: IC1.13(2B1) J1.66
NetIC1_4: IC1.4(1DIR) IC1.5(2DIR) R2.2
NetIC2_4: IC2.4(1DIR) IC2.5(2DIR) R3.2

Not connected (* = marked no-connect by the designer): J1 15 21 23 27 29 33 35 37 39 43 45 47 49 57 59 61 74 76

### Layout directives
differential pair: PCIe1_CLK_N, PCIe1_CLK_P, PCIe1_RX_N, PCIe1_RX_P, PCIe1_TX_N, PCIe1_TX_P, PCIe2_RX_N, PCIe2_RX_P, PCIe2_TX_N, PCIe2_TX_P, SFPRX_N, SFPRX_P, SFPTX_N, SFPTX_P
net class PWR: P3V3_KASLI, P5V0_MP, P12V0_KASLI

### Notes on the sheet
- (near J1) Connector pinout mirrored
- 3V3
- FPGA_TESTPOINT1
- FPGA_TESTPOINT0
- (near J1) S3_TX_P
- FPGA_TESTPOINT3
- FPGA_TESTPOINT2
- (near J1) S2_TX_N
- (near J1) S2_RX_P
- (near J1) S2_RX_N
- (near J1) S1_TX_P
- (near J1) S1_TX_N
- (near J1) S2_TX_P
- (near J1) S3_RX_P
- (near J1) S3_RX_N
- (near J1) S0_TX_P
- (near J1) S0_TX_N
- (near J1) S1_RX_N
- (near J1) S0_RX_P
- (near J1) S0_RX_N
- PCIe_rst
- PCIe_Wake
- (near J1) MGT_CLK_ext_N
- (near J1) MGT_CLK_ext_P
- (near J1) S1_RX_P
- 2V5
- Project/Equipment
- Document
- Designer
- Drawn by
- Check.by
- Copyright WUT ISE 2024.
  This documentation describes Open Hardware and is licensed under the CERN OHL v.2. You may redistribute and modify this documentation under the terms of the CERN OHL v.2. (http://ohwr.org/CERNOHL). This documentation is distributed WITHOUT ANY EXPRESS OR IMPLIED WARRANTY, INCLUDING OF MERCHANTABILITY, SATISFACTORY QUALITY AND FITNESS FOR A PARTICULAR PURPOSE. Please see the CERN OHL v.2 for applicable conditions.
- Contact
- File
- Last Mod.
- Print Date
- Sheet
- Size
- A3
- of
- Rev

### Library data of the parts
C11-C13 = CC0805_22UF_16V_10%_X5R: as C91 on sheet LOCAL_PWR; Manufacturer Part Number: CC0805_22UF_16V_10%_X5R; Part Number: CC0805_22UF_16V_10%_X5R; Value: 22uF; Component Kind: Standard; Component Type: Standard; Pin Count: 2; Status: Preferred; Case: 0805; Mounted: Yes; Socket: No; SMD: Yes; Sense: No; Manufacturer1 Example: TDK; Manufacturer1 ComponentHeight: 1.35mm; HelpURL: \\cern.ch\dfs\Applications\Altium\Datasheets\CC0805_X5R_TDK_C.pdf; Author: CERN DEM JLC; CreateDate: 25.10.2012; LatestRevisionDate: 25.10.2012
C14-C18 C148 = CC0402_100NF_16V_10%_X7R: as C96 on sheet LOCAL_PWR; Part Number: CC0402_100NF_16V_10%_X7R; Component Kind: Standard; Component Type: Standard; Pin Count: 2; Value: 100nF; Status: Not Recommended; Manufacturer Part Number: CC0402_100NF_16V_10%_X7R; Case: 0402; Mounted: Yes; Socket: No; SMD: Yes; Sense: No; Manufacturer1 Example: MURATA; Manufacturer1 ComponentHeight: 0.55mm; HelpURL: \\cern.ch\dfs\Applications\Altium\Datasheets\CC0402_X7R_MURATA_GRM.pdf; Author: CERN DEM JLC; CreateDate: 05/12/2013; LatestRevisionDate: 03/12/2007
IC1-IC3 = SN74AVC4T245RSVR: 4-Bit Dual-Supply Bus Transceiver with Configurable Voltage Translation and 3-State Output; Part Description: 4-Bit Dual-Supply Bus Transceiver with Configurable Voltage Translation and 3-State Outputs; Manufacturer: TEXAS INSTRUMENTS; PressFit: No; Bonding: No; Part Number: SN74AVC4T245RSVR; Component Kind: Standard; Component Type: Standard; Device: SN74AVC4T245RSVR; PackageDescription: QFN, 0.40mm Pitch, Rect.; 16 Pin, 2.60mm L X 1.80mm W X 0.55mm H Body, IPC Medium Density; Status: Not Recommended; Manufacturer Part Number: SN74AVC4T245RSVR; Pin Count: 16; Case: QFN16; Mounted: Yes; Socket: No; SMD: Yes; Sense: No; ComponentHeight: 0.55mm; Author: CERN DEM JLC; HelpURL: \\cern.ch\dfs\Applications\Altium\Datasheets\SN74AVC4T245RSVR.pdf; CreateDate: 08.07.2014; LatestRevisionDate: 30.03.2017
J1 = SAMTEC_LSS-140-01-L-DV-A: Connector 80 Hermaphroditic; Part Description: 80 Contacts, Pitch 0.635mm, Razor Beam LSS Vertical High Speed Hermaphroditic Strip (Lead Style 4.5mm); Manufacturer: SAMTEC; PressFit: No; Part Number: SAMTEC_LSS-140-01-L-DV-A; Component Kind: Standard; Component Type: Standard; Pin Count: 80; Mounted: Yes; Socket: No; SMD: Yes; Sense: No; Status: None; Manufacturer Part Number: LSS-140-01-L-DV-A; ComponentHeight: 4.57mm; HelpURL: \\cern.ch\dfs\Applications\Altium\Datasheets\SAMTEC_LSS-140-01-L-DV-A.pdf; Author: CERN DEM JMW; CreateDate: 10.11.2015; LatestRevisionDate: 10.11.2015
R2 R3 = R0402_1K2_1%_0.0625W_100PPM: Resistor - 1%; Part Description: General Purpose Thick Film Chip Resistor; Manufacturer: GENERIC; Manufacturer 1: YAGEO PHYCOMP; Manufacturer 1 Part Number: 232270671202L; TC: ±100ppm/°C; PressFit: No; Part Number: R0402_1K2_1%_0.0625W_100PPM; Component Kind: Standard; Component Type: Standard; Pin Count: 2; Value: 1k2; Status: Not Recommended; Power: 0.0625W; Manufacturer Part Number: R0402_1K2_1%_0.0625W_100PPM; Case: 0402; Mounted: Yes; Sense: No; Socket: No; SMD: Yes; Manufacturer1 ComponentHeight: 0.4mm; HelpURL: \\cern.ch\dfs\Applications\Altium\Datasheets\R0402_Phycomp_RC0402.pdf; Author: CERN DEM JLC; CreateDate: 03.12.2007; LatestRevisionDate: 17.10.2012

## Sheet M.2_NVME_CON.SchDoc
size 420 x 297 mm; SheetNumber: 9; SheetTotal: 11; ModifiedBy: -; CheckedDate: -; Title2: Title 2; DivGrp: WUT ISE; Designer: G.Kasprowicz
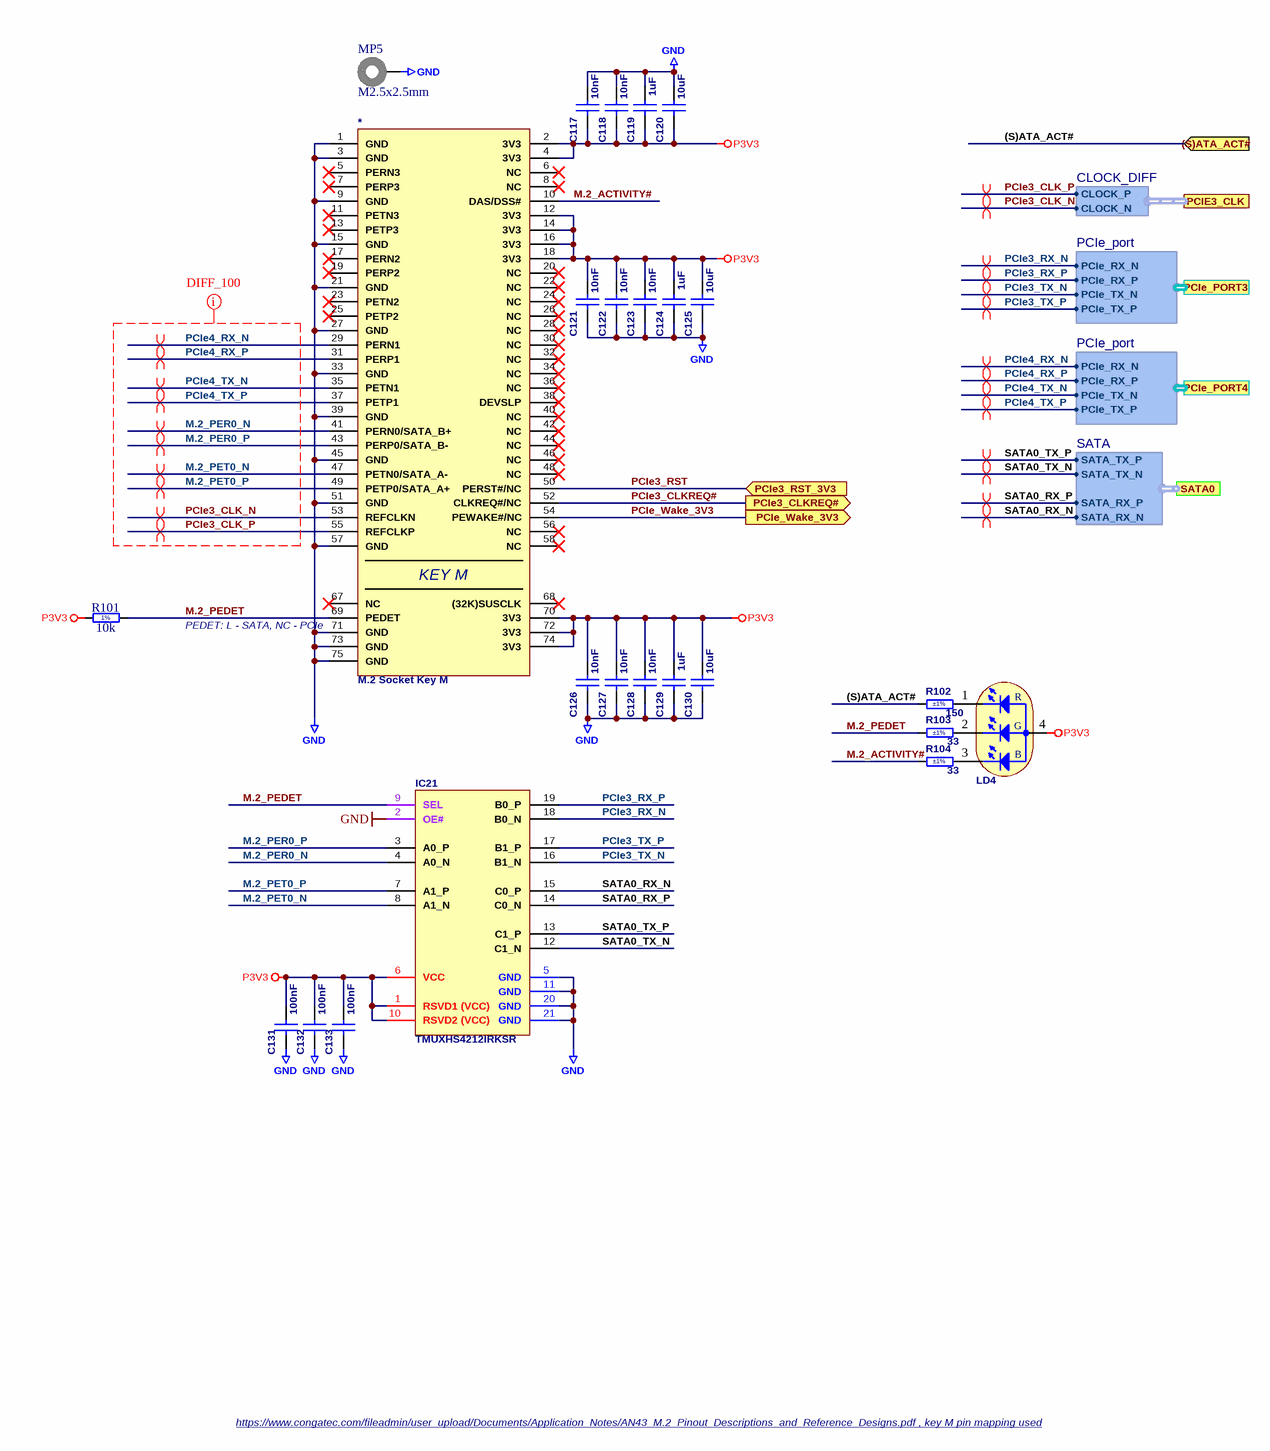
[diagram p8: M.2_NVME_CON.SchDoc]

### Parts
*  M.2 Socket Key M  [FP-1-2199230-6-MFG]
C117  10nF  [CAPC1005X55N]
C118  10nF  [CAPC1005X55N]
C119  1uF  [CAPC1005X55N]
C120  10uF  [CAPC1608X80N]
C121  10nF  [CAPC1005X55N]
C122  10nF  [CAPC1005X55N]
C123  10nF  [CAPC1005X55N]
C124  1uF  [CAPC1005X55N]
C125  10uF  [CAPC1608X80N]
C126  10nF  [CAPC1005X55N]
C127  10nF  [CAPC1005X55N]
C128  10nF  [CAPC1005X55N]
C129  1uF  [CAPC1005X55N]
C130  10uF  [CAPC1608X80N]
C131  100nF  [CAPC1005X55N]
C132  100nF  [CAPC1005X55N]
C133  100nF  [CAPC1005X55N]
IC21  TMUXHS4212IRKSR  [TI_RKS0020A]
LD4  Red/Green/Blue  [LED_OPTEK_OVSRRGBCC3_a]  (value not drawn)
MP5  M2.5x2.5mm  [9774025151]
R101  10k  [RESC1005X40N]
R102  150  Tolerance: ±1%  [RESC1005X40N]
R103  33  Tolerance: ±1%  [RESC1005X40N]
R104  33  Tolerance: ±1%  [RESC1005X40N]

### Ports
(S)ATA_ACT# (in), PCIE3_CLK (harness CLOCK_DIFF), PCIe3_CLKREQ# (out), PCIe3_RST_3V3 (in), PCIe_PORT3 (harness PCIe_port), PCIe_PORT4 (harness PCIe_port), PCIe_Wake_3V3 (out), SATA0 (harness SATA)

### Harnesses
PCIe_port: PCIe_TX_P, PCIe_TX_N, PCIe_RX_P, PCIe_RX_N
CLOCK_DIFF: CLOCK_P, CLOCK_N
SATA: SATA_TX_N, SATA_TX_P, SATA_RX_N, SATA_RX_P

### Nets
GND: *.1(GND) *.3(GND) *.9(GND) *.15(GND) *.21(GND) *.27(GND) *.33(GND) *.39(GND) *.45(GND) *.51(GND) *.57(GND) *.71(GND) *.73(GND) *.75(GND) C117.2 C118.2 C119.2 C120.2 C121.1 C122.1 C123.1 C124.1 C125.1 C126.1 C127.1 C128.1 C129.1 C130.1 C131.1 C132.1 C133.1 IC21.2(OE#) IC21.5(GND) IC21.11(GND) IC21.20(GND) IC21.21(GND) MP5.1
P3V3: *.2(3V3) *.4(3V3) *.12(3V3) *.14(3V3) *.16(3V3) *.18(3V3) *.70(3V3) *.72(3V3) *.74(3V3) C117.1 C118.1 C119.1 C120.1 C121.2 C122.2 C123.2 C124.2 C125.2 C126.2 C127.2 C128.2 C129.2 C130.2 C131.2 C132.2 C133.2 IC21.1(RSVD1_(VCC)) IC21.6(VCC) IC21.10(RSVD2_(VCC)) LD4.4(CC) R101.1
(S)ATA_ACT#: R102.1 ; port (S)ATA_ACT#
M.2_ACTIVITY#: *.10(DAS/DSS#) R104.1
M.2_PEDET: *.69(PEDET) IC21.9(SEL) R101.2 R103.1
M.2_PER0_N: *.41(PERN0/SATA_B+) IC21.4(A0_N)
M.2_PER0_P: *.43(PERP0/SATA_B-) IC21.3(A0_P)
M.2_PET0_N: *.47(PETN0/SATA_A-) IC21.8(A1_N)
M.2_PET0_P: *.49(PETP0/SATA_A+) IC21.7(A1_P)
PCIe3_CLK_N: *.53(REFCLKN) ; port PCIE3_CLK.CLOCK_N
PCIe3_CLK_P: *.55(REFCLKP) ; port PCIE3_CLK.CLOCK_P
PCIe3_CLKREQ#: *.52(CLKREQ#/NC) ; port PCIe3_CLKREQ#
PCIe3_RST: *.50(PERST#/NC) ; port PCIe3_RST_3V3
PCIe3_RX_N: IC21.18(B0_N) ; port PCIe_PORT3.PCIe_RX_N
PCIe3_RX_P: IC21.19(B0_P) ; port PCIe_PORT3.PCIe_RX_P
PCIe3_TX_N: IC21.16(B1_N) ; port PCIe_PORT3.PCIe_TX_N
PCIe3_TX_P: IC21.17(B1_P) ; port PCIe_PORT3.PCIe_TX_P
PCIe4_RX_N: *.29(PERN1) ; port PCIe_PORT4.PCIe_RX_N
PCIe4_RX_P: *.31(PERP1) ; port PCIe_PORT4.PCIe_RX_P
PCIe4_TX_N: *.35(PETN1) ; port PCIe_PORT4.PCIe_TX_N
PCIe4_TX_P: *.37(PETP1) ; port PCIe_PORT4.PCIe_TX_P
PCIe_Wake_3V3: *.54(PEWAKE#/NC) ; port PCIe_Wake_3V3
SATA0_RX_N: IC21.15(C0_P) ; port SATA0.SATA_RX_N
SATA0_RX_P: IC21.14(C0_N) ; port SATA0.SATA_RX_P
SATA0_TX_N: IC21.12(C1_N) ; port SATA0.SATA_TX_N
SATA0_TX_P: IC21.13(C1_P) ; port SATA0.SATA_TX_P
NetLD4_1: LD4.1(AR) R102.2
NetLD4_2: LD4.2(AG) R103.2
NetLD4_3: LD4.3(AB) R104.2

Not connected (* = marked no-connect by the designer): * 5(PERN3)* 6(NC)* 7(PERP3)* 8(NC)* 11(PETN3)* 13(PETP3)* 17(PERN2)* 19(PERP2)* 20(NC)* 22(NC)* 23(PETN2)* 24(NC)* 25(PETP2)* 26(NC)* 28(NC)* 30(NC)* 32(NC)* 34(NC)* 36(NC)* 38(DEVSLP)* 40(NC)* 42(NC)* 44(NC)* 46(NC)* 48(NC)* 56(NC)* 58(NC)* 67(NC)* 68((32K)SUSCLK)*

### Layout directives
net class DIFF_100: M.2_PER0_N, M.2_PER0_P, M.2_PET0_N, M.2_PET0_P, PCIe3_CLK_N, PCIe3_CLK_P, PCIe4_RX_N, PCIe4_RX_P, PCIe4_TX_N, PCIe4_TX_P
differential pair: M.2_PER0_N, M.2_PER0_P, M.2_PET0_N, M.2_PET0_P, PCIe3_CLK_N, PCIe3_CLK_P, PCIe3_RX_N, PCIe3_RX_P, PCIe3_TX_N, PCIe3_TX_P, PCIe4_RX_N, PCIe4_RX_P, PCIe4_TX_N, PCIe4_TX_P, SATA0_RX_N, SATA0_RX_P, SATA0_TX_N, SATA0_TX_P

### Notes on the sheet
- (near *) PEDET: L - SATA, NC - PCIe
- https://www.congatec.com/fileadmin/user_upload/Documents/Application_Notes/AN43_M.2_Pinout_Descriptions_and_Reference_Designs.pdf , key M pin mapping used
- Project/Equipment
- Document
- Designer
- Drawn by
- Check.by
- Copyright WUT ISE 2024.
  This documentation describes Open Hardware and is licensed under the CERN OHL v.2. You may redistribute and modify this documentation under the terms of the CERN OHL v.2. (http://ohwr.org/CERNOHL). This documentation is distributed WITHOUT ANY EXPRESS OR IMPLIED WARRANTY, INCLUDING OF MERCHANTABILITY, SATISFACTORY QUALITY AND FITNESS FOR A PARTICULAR PURPOSE. Please see the CERN OHL v.2 for applicable conditions.
- Contact
- File
- Last Mod.
- Print Date
- Sheet
- Size
- A3
- of
- Rev
- (in symbol LED_OPTEK_OVSRRGBCC3_a) R; G; B
- (in symbol M.2 Socket Key M) KEY M
- (in symbol R0402_10K_1%_0.0625W_100PPM) 1%

### Library data of the parts
C117 C118 C121-C123 C126-C128 = CC0402_10NF_16V_10%_X7R: Non-polarised capacitor; Part Description: SMD Multilayer Chip Ceramic Capacitor; Manufacturer: GENERIC; Manufacturer1 Part Number: 223878715636; Voltage: 16V; TC: X7R; Tolerance: ±10%; Part Number: CC0402_10NF_16V_10%_X7R; Component Kind: Standard; Component Type: Standard; Pin Count: 2; Value: 10nF; Status: Not Recommended; Manufacturer Part Number: CC0402_10NF_16V_10%_X7R; Case: 0402; Mounted: Yes; Socket: No; SMD: Yes; Sense: No; Manufacturer1 Example: PHYCOMP; Manufacturer1 ComponentHeight: 0.55mm; HelpURL: \\cern.ch\dfs\Applications\Altium\Datasheets\CC0402_X7R_PHYCOMP.pdf; Author: CERN DEM JLC; CreateDate: 03.12.2007; LatestRevisionDate: 03.12.2007
C119 C124 C129 = CC0402_1UF_16V_10%_X5R: as C99 on sheet LOCAL_PWR; Part Number: CC0402_1UF_16V_10%_X5R; Component Kind: Standard; Component Type: Standard; Pin Count: 2; Value: 1uF; Status: Preferred; Manufacturer Part Number: CC0402_1UF_16V_10%_X5R; Case: 0402; Mounted: Yes; Socket: No; SMD: Yes; Sense: No; Manufacturer1 Example: TDK; Manufacturer1 ComponentHeight: 0.55mm; HelpURL: \\cern.ch\dfs\Applications\Altium\Datasheets\CC0402_X5R_TDK_C.pdf; Author: CERN DEM JLC; CreateDate: 2012-10-25; LatestRevisionDate: 2012-10-25
C120 C125 C130 = CC0603_10UF_16V_20%_X5R: Non-polarised capacitor; Part Description: SMD Multilayer Chip Ceramic Capacitor; Manufacturer: GENERIC; Manufacturer1 Part Number: GRM188R61C106MA73D; Voltage: 16V; TC: X5R; Tolerance: ±20%; Part Number: CC0603_10UF_16V_20%_X5R; Component Kind: Standard; Component Type: Standard; Pin Count: 2; Value: 10uF; Status: None; Manufacturer Part Number: CC0603_10UF_16V_20%_X5R; Case: 0603; Mounted: Yes; Socket: No; SMD: Yes; Sense: No; Manufacturer1 Example: MURATA; Manufacturer1 ComponentHeight: 0.8mm; HelpURL: \\cern.ch\dfs\Applications\Altium\Datasheets\CC0603_X5R_MURATA_GRM.pdf; Author: CERN DEM MR; CreateDate: 02.03.2016; LatestRevisionDate: 02.03.2016
C131-C133 = CC0402_100NF_16V_10%_X7R: as C96 on sheet LOCAL_PWR; Part Number: CC0402_100NF_16V_10%_X7R; Component Kind: Standard; Component Type: Standard; Pin Count: 2; Value: 100nF; Status: Not Recommended; Manufacturer Part Number: CC0402_100NF_16V_10%_X7R; Case: 0402; Mounted: Yes; Socket: No; SMD: Yes; Sense: No; Manufacturer1 Example: MURATA; Manufacturer1 ComponentHeight: 0.55mm; HelpURL: \\cern.ch\dfs\Applications\Altium\Datasheets\CC0402_X7R_MURATA_GRM.pdf; Author: CERN DEM JLC; CreateDate: 05/12/2013; LatestRevisionDate: 03/12/2007
IC21 = TMUXHS4212: Two-Channel Differential 2:1 MUX or 1:2 Demux
LD4 = LED_OPTEK_OVSRRGBCC3_a: Right Angle Tricolor (RGB) Surface Mount LED, Body 3.2x1mm; Part Description: Side Mount, Full-Color (RGB), 1204 Surface Mount LED (150° Viewing Angle); Manufacturer: OPTEK / TT ELECTRONICS; PressFit: No; Bonding: No; Part Number: LED_OPTEK_OVSRRGBCC3_a; Component Kind: Standard; Component Type: Standard; Color: Red/Green/Blue; PackageDescription: Side Mount, Full-Color (RGB), 1204 Surface Mount LED (150° Viewing Angle); Manufacturer Part Number: OVSRRGBCC3; Pin Count: 4; Case: 1204; Mounted: Yes; Socket: No; SMD: Yes; Sense: No; ComponentHeight: 1mm; HelpURL: \\cern.ch\dfs\Applications\Altium\Datasheets\LED_OPTEK_OVSRRGBCC3.pdf; Author: CERN DEM JLC; CreateDate: 09.08.2011; LatestRevisionDate: 09.08.2011
MP5 = 9774025151: WA-SMSI SMT Steel Spacer, internal Thread, OD 5.1mm, M2.5x2.5mm; Manufacturer: Wurth Elektronik; Inner Diameter: 3.5mm; Surface: Tin; Thread: M2.5; ComponentLink1Description: Manufacturer; ComponentLink1URL: http://www.we-online.de; ComponentLink2Description: Datasheet; ComponentLink2URL: https://www.we-online.com/catalog/datasheet/9774025151.pdf; Mounting Technology: SMT; Packaging: Bulk; Manufacturer Part Number: 9774025151; Length: 2.5mm; Inner Thread Length: -; Operating Temperature: -55 to +150degC; Outer Diameter: 5.1mm; Published Date: April 2020; Material: Steel
R101 = R0402_10K_1%_0.0625W_100PPM: Resistor - 1%; Part Description: General Purpose Thick Film Chip Resistor; Manufacturer: GENERIC; Manufacturer1 Part Number: 232270671003L; TC: ±100ppm/°C; Table: Resistors SMD; Part Number: R0402_10K_1%_0.0625W_100PPM; Component Kind: Standard; Component Type: Standard; Pin Count: 2; Value: 10k; Status: Not recommended; Power: 0.0625W; Tolerance: ±1%; Manufacturer Part Number: R0402_10K_1%_0.0625W_100PPM; Case: 0402; Mounted: Yes; Socket: No; SMD: Yes; Manufacturer1 Example: YAGEO PHYCOMP; Manufacturer1 ComponentHeight: 0.4mm; HelpURL: \\cern.ch\dfs\Applications\Altium\Datasheets\R0402_Phycomp_RC0402.pdf; Author: CERN DEM JLC; CreateDate: 2007-12-03; LatestRevisionDate: 2012-10-17
R102 = R0402_150R_1%_0.0625W_100PPM: Resistor - 1%; Part Description: General Purpose Thick Film Chip Resistor; Manufacturer: GENERIC; Manufacturer1 Part Number: 232270671501L; TC: ±100ppm/°C; PressFit: No; Part Number: R0402_150R_1%_0.0625W_100PPM; Component Kind: Standard; Component Type: Standard; Pin Count: 2; Value: 150; Status: Not Recommended; Power: 0.0625W; Manufacturer Part Number: R0402_150R_1%_0.0625W_100PPM; Case: 0402; Mounted: Yes; Sense: No; Socket: No; SMD: Yes; Manufacturer1 Example: YAGEO PHYCOMP; Manufacturer1 ComponentHeight: 0.4mm; HelpURL: \\cern.ch\dfs\Applications\Altium\Datasheets\R0402_Phycomp_RC0402.pdf; Author: CERN DEM JLC; CreateDate: 03.12.2007; LatestRevisionDate: 17.10.2012
R103 R104 = R0402_33R_1%_0.0625W_100PPM: Resistor - 1%; Part Description: General Purpose Thick Film Chip Resistor; Manufacturer: GENERIC; Manufacturer1 Part Number: 232270673309L; TC: ±100ppm/°C; PressFit: No; Part Number: R0402_33R_1%_0.0625W_100PPM; Component Kind: Standard; Component Type: Standard; Pin Count: 2; Value: 33; Status: Not Recommended; Power: 0.0625W; Manufacturer Part Number: R0402_33R_1%_0.0625W_100PPM; Case: 0402; Mounted: Yes; Sense: No; Socket: No; SMD: Yes; Manufacturer1 Example: YAGEO PHYCOMP; Manufacturer1 ComponentHeight: 0.4mm; HelpURL: \\cern.ch\dfs\Applications\Altium\Datasheets\R0402_Phycomp_RC0402.pdf; Author: CERN DEM JLC; CreateDate: 03.12.2007; LatestRevisionDate: 17.10.2012